# EAGLE design picopower (EAGLE 9.6.2)
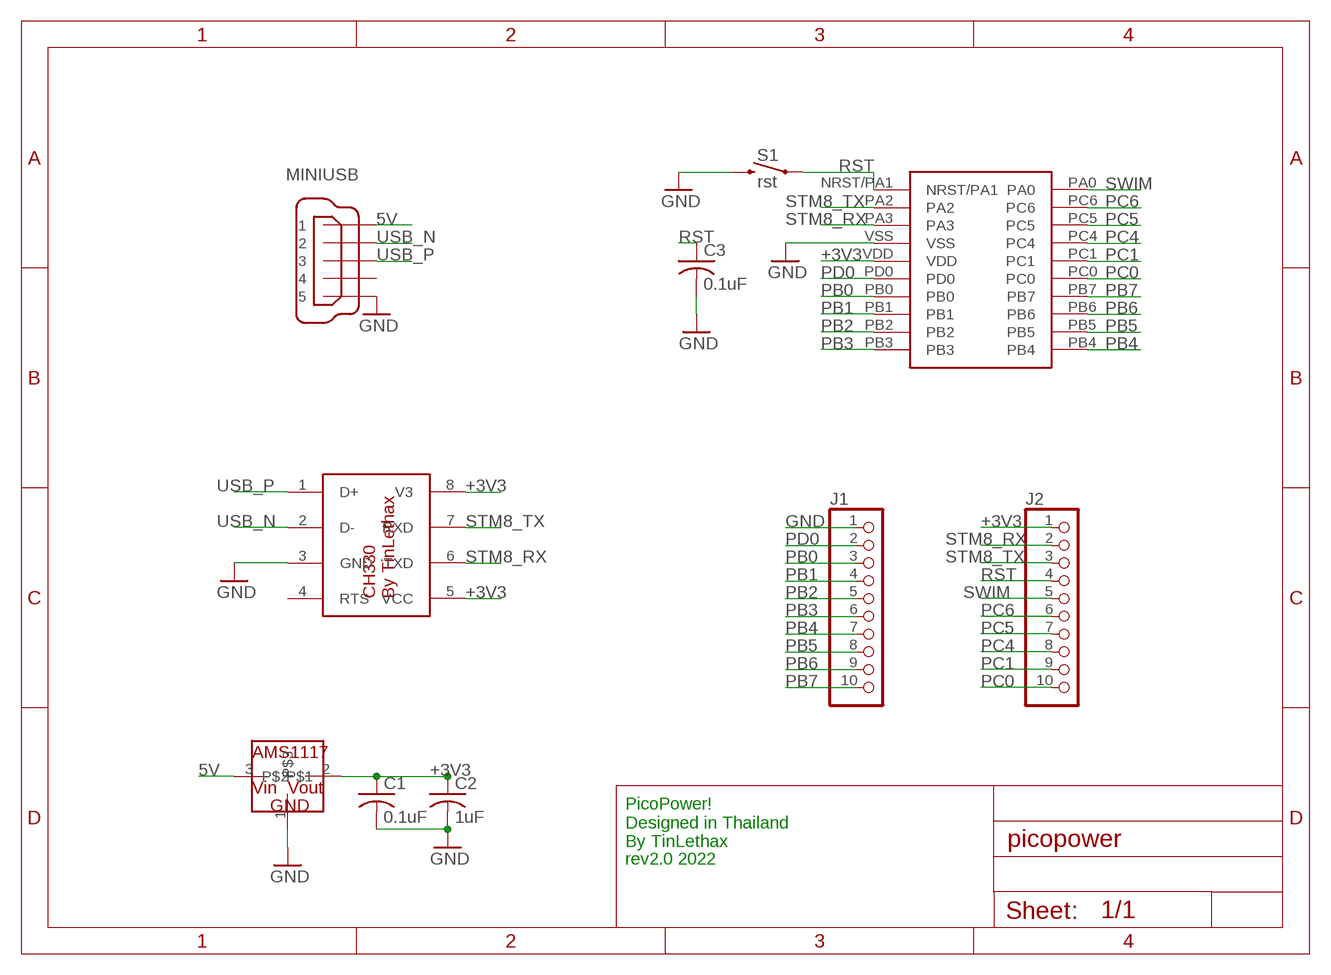
[diagram p0: schematic, sheet 1]

## Parts
C1  0.1uF  C-USC0603K  [C0603K]
C2  1uF  C-USC0603K  [C0603K]
C3  0.1uF  C-USC0603K  [C0603K]
IC1  STM8L151F3  [UFQFPN-20]
IC2  CH330  [SOIC127P600X150-8N]
IC3  AMS1117  [SOT223]
J1  PINHD-1X10  [1X10-BIG]
J2  PINHD-1X10  [1X10-BIG]
MINIUSB  MINI-USB-UX60A-MB-5ST  [UX60A-MB-5ST]
S1  rst  MOMENTARY-SWITCH-SPST-SMD-RIGHT-ANGLE  [TACTILE_SWITCH_SMD_RIGHT_ANGLE]

## Nets
5V: IC3.3 MINIUSB.1
+3V3: C1.1 C2.1 IC1.VDD IC2.5(VCC) IC2.8(V3) IC3.2 J2.1
GND: C1.2 C2.2 C3.2 IC1.VSS IC2.3(GND) IC3.1 J1.1 MINIUSB.5 S1.2
PB0: IC1.PB0 J1.3
PB1: IC1.PB1 J1.4
PB2: IC1.PB2 J1.5
PB3: IC1.PB3 J1.6
PB4: IC1.PB4 J1.7
PB5: IC1.PB5 J1.8
PB6: IC1.PB6 J1.9
PB7: IC1.PB7 J1.10
PC0: IC1.PC0 J2.10
PC1: IC1.PC1 J2.9
PC4: IC1.PC4 J2.8
PC5: IC1.PC5 J2.7
PC6: IC1.PC6 J2.6
PD0: IC1.PD0 J1.2
RST: C3.1 IC1.NRST/PA1 J2.4 S1.1
STM8_RX: IC1.PA3 IC2.6(TXD) J2.2
STM8_TX: IC1.PA2 IC2.7(RXD) J2.3
SWIM: IC1.PA0 J2.5
USB_N [USB]: IC2.2(D-) MINIUSB.2
USB_P [USB]: IC2.1(D+) MINIUSB.3
Unconnected: IC2.4(RTS) MINIUSB.4

## Notes on the sheet
- PicoPower! 
  Designed in Thailand
  By TinLethax
- rev2.0 2022

## Library data of the parts
C1-C3 = adafruit:C-US: CAPACITOR, American symbol
IC1 = STM8L151F3:STM8L151F3: STM8L151F3 8bit mcuwith the 3x3 mm size !
IC2 = CH330:CH330: CH330 Super small Serial to USB chip; DESCRIPTION: CH330 Super small Serial to USB chip; PACKAGE: SOP8; PARTNO: CH330
IC3 = AMS1117:AMS1117: The The AMS1117 series of adjustable and fixed voltage regulators are designed to provide up to1A output current and to operate down to 1V input-to-output differential. The dropout voltage of the device is guaranteed maximum 1.3V, decreasing at lower load currents.; PARTNO: AMS1117
J1 J2 = adafruit:PINHD-1X10: Pin header 1x10 0.1" spacing With round pins
MINIUSB = con-hirose:MINI-USB-: MINI USB Connector Source: http://www.hirose.co.jp/cataloge_hp/e24000019.pdf; OC_FARNELL: unknown; OC_NEWARK: unknown
S1 = SparkFun-Switches:MOMENTARY-SWITCH-SPST: Momentary Switch (Pushbutton) - SPST Normally-open (NO) SPST momentary switches (buttons, pushbuttons). Variants PTH-12MM - 12mm square, through-hole Momentary Pushbutton Switch - 12mm Square <https://www.sparkfun.com/products/9190> (COM-09190) PTH-6.0MM, PTH-6.0MM-KIT - 6.0mm square, through-hole Mini Pushbutton Switch <https://www.sparkfun.com/products/97> (COM-00097) KIT package intended for soldering kit's - only one side of pads' copper is exposed. PTH-RIGHT-ANGLE-KIT - Right-angle, through-hole Right Angle Tactile Button <https://www.sparkfun.com/products/10791> - Used on SparkFun BigTime Watch Kit <https://www.sparkfun.com/products/11734> SMD-12MM - 12mm square, surface-mount Tactile Button - SMD (12mm) <https://www.sparkfun.com/products/12993> (COM-12993) Used on SparkFun PicoBoard <https://www.sparkfun.com/products/11888> SMD-4.5MM - 4.5mm Square Trackball Switch Used on SparkFun Blackberry Trackballer Breakout <https://www.sparkfun.com/products/13169> SMD-4.6MMX2.8MM - 4.60mm x 2.80mm, surface mount Used on SparkFun SAMD21 Mini Breakout <https://www.sparkfun.com/products/13664> SMD-5.2MM, SMD-5.2-REDUNDANT - 5.2mm square, surface-mount Mini Pushbutton Switch - SMD <https://www.sparkfun.com/products/8720> (COM-08720) Used on Arduino Pro Mini <https://www.sparkfun.com/products/11114> REDUNDANT package connects both switch circuits together SMD-6.0X3.5MM - 6.0 x 3.5mm, surface mount Momentary Reset Switch SMD <https://www.sparkfun.com/products/8229> (COM-08229) SMD-6.2MM-TALL - 6.2mm square, surface mount Tactile Button - SMD (6mm) <https://www.sparkfun.com/products/12992> Used on SparkFun Digital Sandbox <https://www.sparkfun.com/products/12651> SMD-RIGHT-ANGLE - Right-angle, surface mount Used on SparkFun Block for Intel® Edison - Arduino <https://www.sparkfun.com/products/13036>; PROD_ID: COMP-12265

## Board
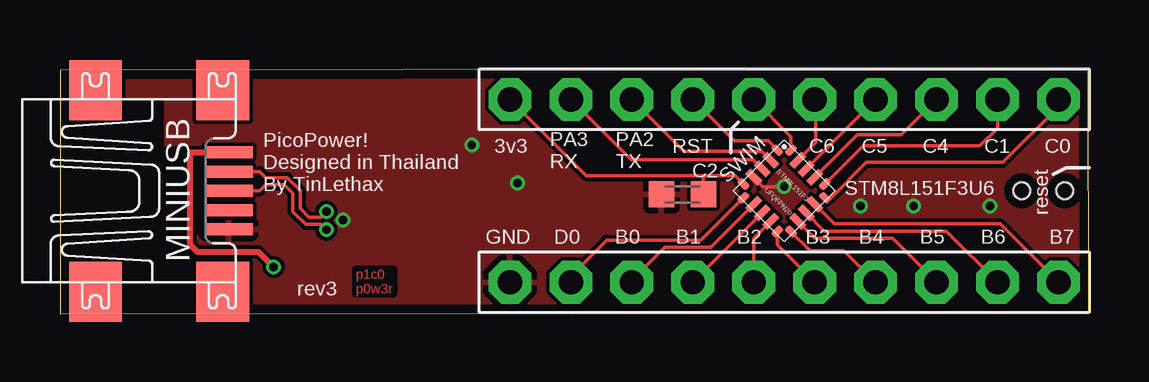
[diagram p1: board, top side]
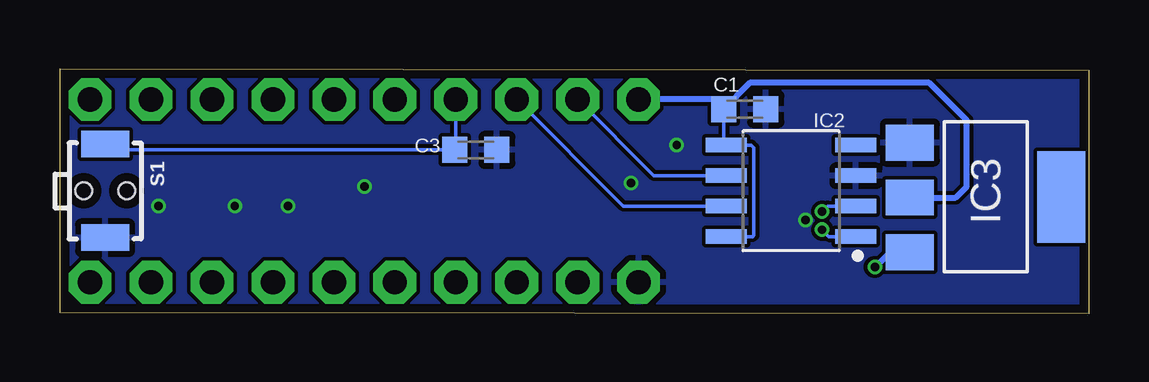
[diagram p2: board, bottom side, seen from below]

Size 42.86 x 10.21 mm. Coordinates in mm from the lower left corner, seen from the top.
Outline: 0,0 42.86,0.05 42.85,10.21 0,10.16 0,0
Copper layers (1*16): Top 0.035559375mm / dielectric 1.6mm / Bottom 0.035559375mm
Design rules "oshpark-2layer": minimum track width 6mil, minimum drill 10mil, track to track 6mil, track to pad 6mil, pad to pad 6mil, via to via 6mil, smd to smd 6mil, copper to edge 15mil, drill to drill 6mil, minimum pad ring 5mil, minimum via ring 5mil, stop-mask expansion 2.5mil, vias tented up to drill 0mil, thermal gap 10mil

### Footprints (pad centres in the part's own frame; a part is rotated, then mirrored left to right if it is on the bottom)
C0603K = smd 1.05 x 1.08: 1 -0.875,0; 2 0.875,0
UFQFPN-20 = smd 0.5 x 0.3: NRST/PA1 -1.4,1; PB4 1.4,-1; PC0 1.4,1; VDD -1.4,-1 | smd 0.3 x 0.5: PA0 -1,1.4; PB3 1,-1.4; PC1 1,1.4; PD0 -1,-1.4 | smd 0.7 x 0.3: PA2 -1.3,0.5; PA3 -1.3,0; PB5 1.3,-0.5; PB6 1.3,0; PB7 1.3,0.5; VSS -1.3,-0.5 | smd 0.3 x 0.7: PB0 -0.5,-1.3; PB1 0,-1.3; PB2 0.5,-1.3; PC4 0.5,1.3; PC5 0,1.3; PC6 -0.5,1.3
SOIC127P600X150-8N = smd 1.708 x 0.602: 1 -2.7,1.905; 2 -2.7,0.635; 3 -2.7,-0.635; 4 -2.7,-1.905; 5 2.7,-1.905; 6 2.7,-0.635; 7 2.7,0.635; 8 2.7,1.905
SOT223 = smd 1.499 x 2.007: 1 -2.261,-3.15; 2 0.025,-3.15; 3 2.311,-3.15 | smd 3.81 x 2.007: 4 0,3.15
1X10-BIG = drill 1.016 pad 1.778 octagon: 1 -11.43,0; 2 -8.89,0; 3 -6.35,0; 4 -3.81,0; 5 -1.27,0; 6 1.27,0; 7 3.81,0; 8 6.35,0; 9 8.89,0; 10 11.43,0
UX60A-MB-5ST = smd 2 x 0.5: 1 2.25,1.6; 2 2.25,0.8; 3 2.25,0; 4 2.25,-0.8; 5 2.25,-1.6 | smd 2.2 x 2.5: M1 -3.3,-4.2; M2 -3.3,4.2; M3 2,4.2; M4 2,-4.2
TACTILE_SWITCH_SMD_RIGHT_ANGLE = smd 1.1 x 2: 1 -1.95,0; 2 1.95,0 | hole 0.7: 0,0.9; 0,-0.9

### Placement (x,y rotation side)
C1  14.33,8.53 0 bottom
C2  25.93,4.98 180 top
C3  25.53,6.83 0 bottom
IC1  30.18,5.13 315 top
IC2  12.4,5.13 180 bottom
IC3  4.29,4.88 270 bottom
J1  30.18,1.32 0 top
J2  30.18,8.94 0 top
MINIUSB  4.78,5.13 0 top
S1  40.97,5.13 270 bottom

### Tracks (layer width: path | path; a pad name or v marks a point on that pad's centre or on a via)
5V  (via drill 0.35)
  Top 0.254: 6.97,6.68 MINIUSB.1 7.01,6.72 5.41,6.72 5.41,2.91 5.73,2.59 8.27,2.59 v8.9,1.96
  Bottom 0.152: 8.27,2.57 8.18,2.57 7.95,2.57 IC3.3
  Bottom 0.254: v8.9,1.96 8.88,1.96 8.27,2.57
+3V3
  Top 0.152: J2.1 21.92,5.77 26.77,5.77 | IC1.VDD 28.13,5.77 26.77,5.77 | C2.1 26.81,5.73 26.77,5.77
  Bottom 0.152: IC2.8 14,3.23 13.94,3.28 13.94,6.93 14.05,7.04 IC2.5 15.2,7.14 C1.1 | IC3.2 7.75,5.16
  Bottom 0.254: IC3.2 5.54,4.85 5.08,5.31 5.08,8.08 6.63,9.63 14.11,9.63 C1.1 15.61,8.94 J2.1
GND  (via drill 0.35)
  Top 0.152: IC1.VSS 29.29,5.31 v30.18,5.31
  Bottom 0.152: v30.18,5.31 30.15,5.31
  Bottom 0.305: IC3.1 7.87,7.57
  other vias: 33.35,4.5 35.57,4.5 38.75,4.5 17.16,7.04 19.06,5.45 11.79,3.91
  pour Top: -0.3,10.21 -0.3,0.05 42.88,0.05 42.88,10.21
  pour Bottom: -0.3,10.21 -0.3,0.05 42.88,0.05 42.88,10.21
PB0
  Top 0.152: IC1.PB0 27.11,2.77 25.19,2.77 23.83,1.4 J1.3
PB1
  Top 0.152: IC1.PB1 J1.4
PB2
  Top 0.152: IC1.PB2 28.91,3.15 J1.5
PB3
  Top 0.152: IC1.PB3 29.89,2.87 J1.6
PB4
  Top 0.152: IC1.PB4 31.25,2.64 32.66,2.64 J1.7
PB5
  Top 0.152: IC1.PB5 31.45,3.15 34.7,3.15 J1.8
PB6
  Top 0.152: IC1.PB6 31.85,3.45 36.94,3.45 J1.9
PB7
  Top 0.152: IC1.PB7 32.25,3.76 39.17,3.76 J1.10
PC0
  Top 0.152: IC1.PC0 31.92,4.8 32.09,4.8 33.6,6.31 39.28,6.31 41.61,8.64 J2.10
PC1
  Top 0.152: IC1.PC1 33.47,7.01 38.33,7.01 39.07,7.75 J2.9
PC4
  Top 0.152: IC1.PC4 33.22,7.47 35.05,7.47 J2.8
PC5
  Top 0.152: IC1.PC5 J2.7
PC6
  Top 0.152: IC1.PC6 31.48,7.15 31.48,8.94 J2.6
PD0
  Top 0.152: IC1.PD0 26.7,3.07 22.78,3.07 21.29,1.58 J1.2
RST
  Top 0.152: J2.4 28.09,7.21 29.51,7.21 IC1.NRST/PA1
  Bottom 0.152: J2.4 26.37,7.33 C3.1 40.72,6.83 S1.1
STM8_RX
  Top 0.152: J2.2 23.8,6.43 28.88,6.43 IC1.PA3
  Bottom 0.152: IC2.6 18.11,5.77 J2.2
STM8_TX
  Top 0.152: J2.3 25.98,6.78 29.23,6.78 IC1.PA2
  Bottom 0.152: IC2.7 19.38,4.5 J2.3
SWIM
  Top 0.152: J2.5 30.46,7.39 IC1.PA0
USB_N  (via drill 0.35)
  Top 0.152: MINIUSB.2 8.33,5.93 8.58,5.68 9.47,5.68 10.01,5.15 10.01,4.39 10.36,4.04 10.87,4.04 v11.1,4.26
  Bottom 0.152: IC2.2 10.87,4.5 v11.1,4.26
USB_P  (via drill 0.35)
  Top 0.152: MINIUSB.3 8.33,5.13 8.58,5.38 9.35,5.38 9.7,5.02 9.7,4.27 10.24,3.73 10.87,3.73 v11.1,3.51
  Bottom 0.152: IC2.1 10.82,3.23 v11.1,3.51

### Text on the board
Top: p1c0 / p0w3r
tNames: 3v3 | RST | C6 | C5 | C4 | C1 | C0 | PA3 / RX | PA2 / TX | SWIM | PicoPower! / Designed in Thailand / By TinLethax | STM8L151F3U6 | reset | GND | D0 | B0 | B1 | B2 | B3 | B4 | B5 | B6 | B7 | rev3